# Altium schematic sheet E17-04_Charger Control.SchDoc
size A; DocumentNumber: 17; SheetNumber: 17; SheetTotal: 18
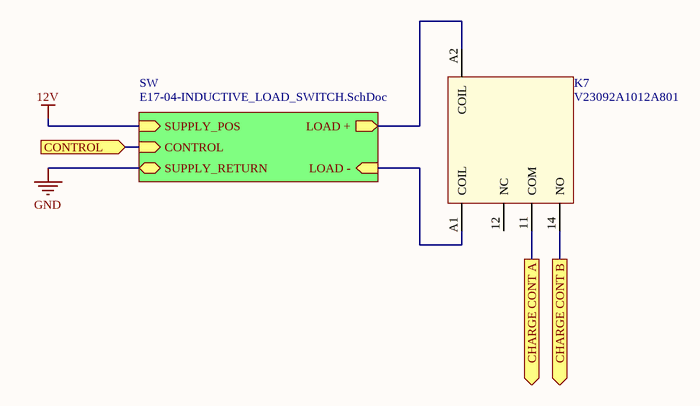
[diagram p0: E17-04_Charger Control.SchDoc]

## Parts
K7  V23092A1012A801  [SCHRACK]

## Sub-sheets
SW = E17-04-INDUCTIVE_LOAD_SWITCH.SchDoc: CONTROL (in), LOAD + (out), SUPPLY_POS (in), LOAD - (in), SUPPLY_RETURN

## Ports
CHARGE CONT A (out), CHARGE CONT B (out), CONTROL (in)

## Nets
12V: sheet SW/SUPPLY_POS
GND: sheet SW/SUPPLY_RETURN
CHARGE CONT A: K7.11(COM) ; port CHARGE CONT A
CHARGE CONT B: K7.14(NO) ; port CHARGE CONT B
CONTROL: port CONTROL, sheet SW/CONTROL
NetK7_A1: K7.A1(COIL) ; sheet SW/LOAD -
NetK7_A2: K7.A2(COIL) ; sheet SW/LOAD +

Not connected (* = marked no-connect by the designer): K7 12(NC)

## Library data of the parts
K7 = V23092A1012A801: 12V slim SPDT Relay; MFG: TE; DC Contact Voltage: 300; Coil Voltage: 12; Coil Current: 0.0142; DIGIKEY_PN: PB2044-ND; Supplier 1: Digikey; Supplier Part Number 1: PB2044-ND; MFG_PN: V23092A1012A801